# EAGLE design MagnetLCD (EAGLE 5.11)
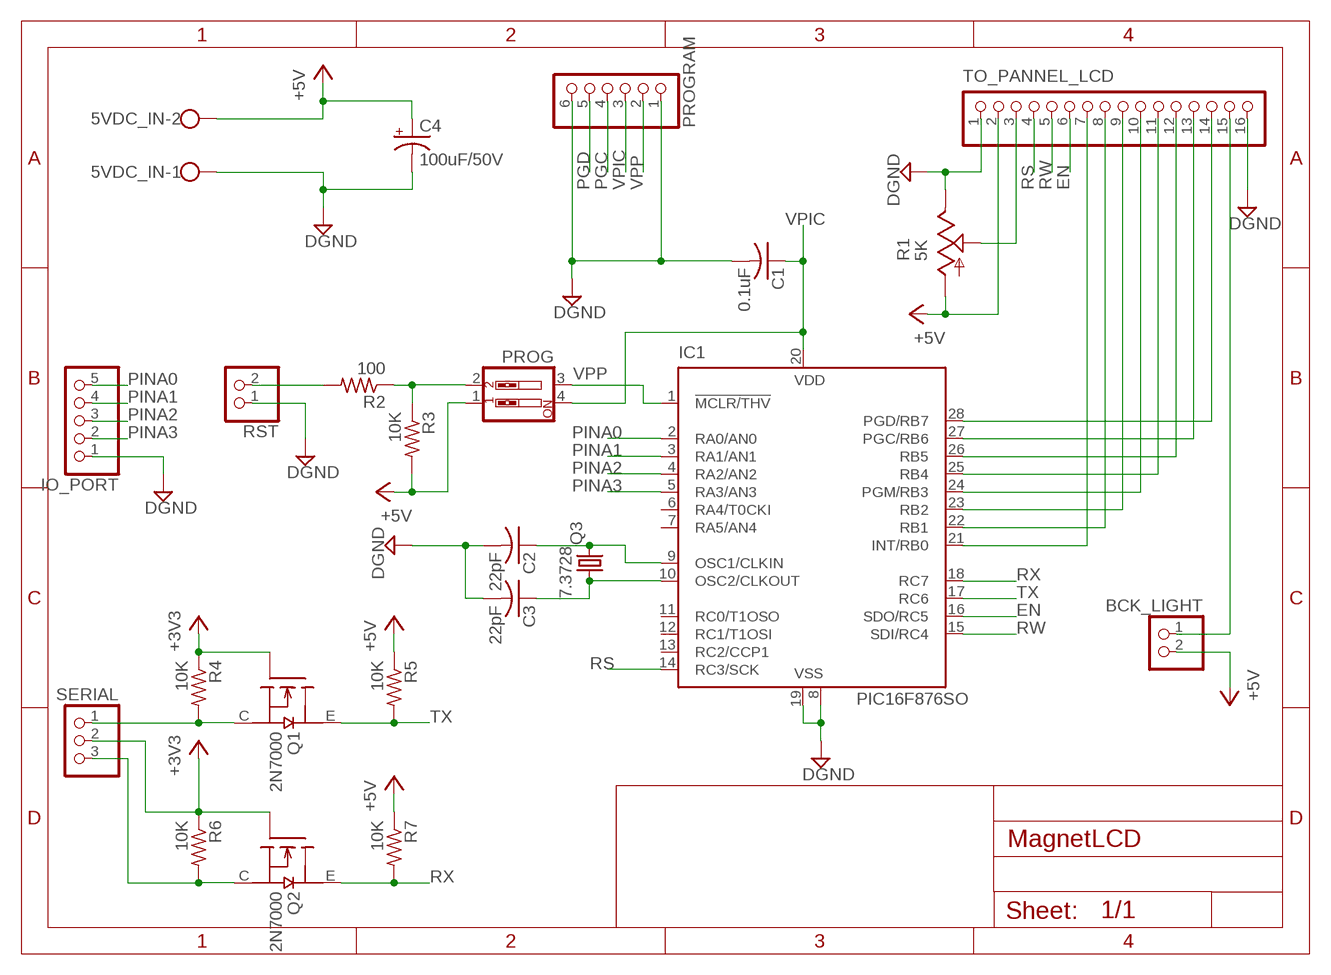
[diagram p0: schematic, sheet 1]

## Parts
5VDC_IN  W237-102  [W237-102]
BCK_LIGHT  PINHD-1X2  [1X02]
C1  0.1uF  C-USC0603  [C0603]
C2  22pF  C-USC0603  [C0603]
C3  22pF  C-USC0603  [C0603]
C4  100uF/50V  CPOL-USE3.5-8  [E3,5-8]
IC1  PIC16F876SO  [SO28W]
IO_PORT  PINHD-1X5/90  [1X05/90]
PROG  SW_DIP-2  [EDG-02]
PROGRAM  PINHD-1X6/90  [1X06/90]
Q1  2N7000  [TO92]
Q2  2N7000  [TO92]
Q3  7.3728  CRYSTALSM49  [SM49]
R1  5K  TRIM_US-CA9V  [CA9V]
R2  100  R-US_R0603  [R0603]
R3  10K  R-US_R0603  [R0603]
R4  10K  R-US_R0603  [R0603]
R5  10K  R-US_R0603  [R0603]
R6  10K  R-US_R0603  [R0603]
R7  10K  R-US_R0603  [R0603]
RST  PINHD-1X2/90  [1X02/90]
SERIAL  PINHD-1X3/90  [1X03/90]
TO_PANNEL_LCD  PINHD-1X16  [1X16]

## Nets
+3V3: Q1.B(G) Q2.B(G) R4.1 R6.1 SERIAL.2
+5V: 5VDC_IN.2 BCK_LIGHT.2 C4.+ PROG.1 R1.A R3.2 R5.1 R7.1 TO_PANNEL_LCD.2
DGND: 5VDC_IN.1 C1.2 C2.2 C3.2 C4.- IC1.8(VSS) IC1.19(VSS) IO_PORT.1 PROGRAM.1 PROGRAM.6 R1.E RST.1 TO_PANNEL_LCD.1 TO_PANNEL_LCD.16
EN: IC1.16(SDO/RC5) TO_PANNEL_LCD.6
N$1: R1.S TO_PANNEL_LCD.3
N$2: IC1.21(INT/RB0) TO_PANNEL_LCD.7
N$3: IC1.22(RB1) TO_PANNEL_LCD.8
N$4: IC1.23(RB2) TO_PANNEL_LCD.9
N$5: IC1.24(PGM/RB3) TO_PANNEL_LCD.10
N$6: IC1.25(RB4) TO_PANNEL_LCD.11
N$7: IC1.26(RB5) TO_PANNEL_LCD.12
N$8: PROG.2 R2.1 R3.1
N$9: R2.2 RST.2
N$10: Q1.C(S) R4.2 SERIAL.1
N$11: Q2.C(S) R6.2 SERIAL.3
N$12: C2.1 IC1.9(OSC1/CLKIN) Q3.2
N$13: C3.1 IC1.10(OSC2/CLKOUT) Q3.1
N$18: BCK_LIGHT.1 TO_PANNEL_LCD.15
PGC: IC1.27(PGC/RB6) PROGRAM.4 TO_PANNEL_LCD.13
PGD: IC1.28(PGD/RB7) PROGRAM.5 TO_PANNEL_LCD.14
PINA0: IC1.2(RA0/AN0) IO_PORT.5
PINA1: IC1.3(RA1/AN1) IO_PORT.4
PINA2: IC1.4(RA2/AN2) IO_PORT.3
PINA3: IC1.5(RA3/AN3) IO_PORT.2
RS: IC1.14(RC3/SCK) TO_PANNEL_LCD.4
RW: IC1.15(SDI/RC4) TO_PANNEL_LCD.5
RX: IC1.18(RC7) Q2.E(D) R7.2
TX: IC1.17(RC6) Q1.E(D) R5.2
VPIC: C1.1 IC1.20(VDD) PROG.4 PROGRAM.3
VPP: IC1.1(!MCLR/THV) PROG.3 PROGRAM.2
Unconnected: IC1.6(RA4/T0CKI) IC1.7(RA5/AN4) IC1.11(RC0/T1OSO) IC1.12(RC1/T1OSI) IC1.13(RC2/CCP1)

## Library data of the parts
5VDC_IN = con-wago-500:W237-102: WAGO SCREW CLAMP; MPN: 237-102; OC_FARNELL: unknown; OC_NEWARK: 70K9898
BCK_LIGHT RST = pinhead:PINHD-1X2: PIN HEADER
C1-C3 = rcl:C-US: CAPACITOR, American symbol
C4 = rcl:CPOL-US: POLARIZED CAPACITOR, American symbol
IC1 = microchip:PIC16*876: MICROCONTROLLER flash type; MF: MICROCHIP; MPN: PIC16F876-20/SO; OC_FARNELL: 9761268; OC_NEWARK: 12C1950
IO_PORT = pinhead:PINHD-1X5: PIN HEADER
PROG = special:SW_DIP-2: DIP SWITCH
PROGRAM = pinhead:PINHD-1X6: PIN HEADER
Q1 Q2 = Ricardo_Library:2N7000
Q3 = crystal:CRYSTAL: CRYSTAL; OC_FARNELL: unknown; OC_NEWARK: unknown
R1 = pot:TRIM_US-: POTENTIOMETER
R2-R7 = rcl:R-US_: RESISTOR, American symbol
SERIAL = pinhead:PINHD-1X3: PIN HEADER
TO_PANNEL_LCD = pinhead:PINHD-1X16: PIN HEADER

## Board
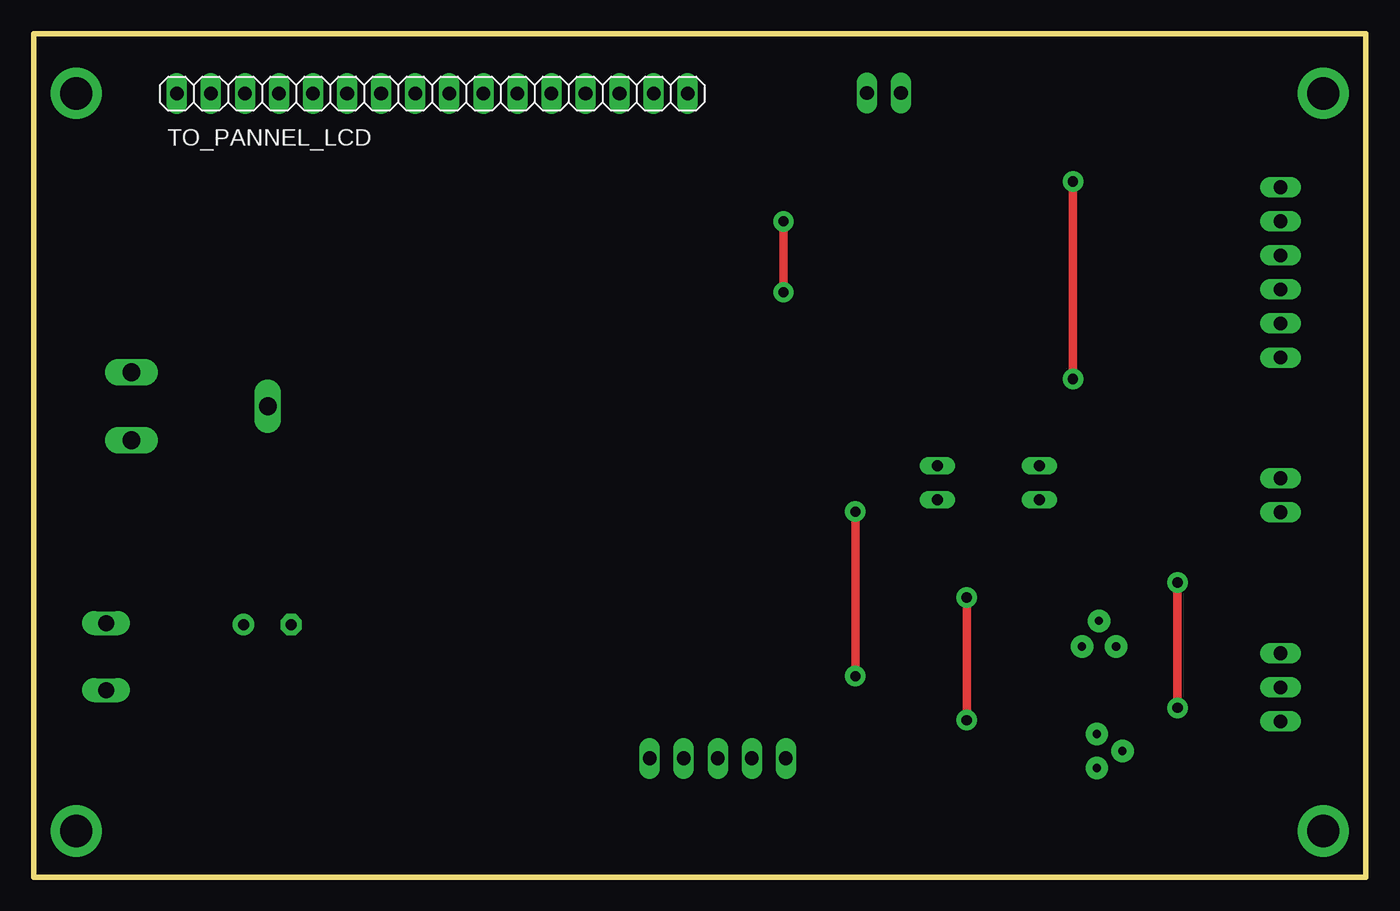
[diagram p1: board, top side]
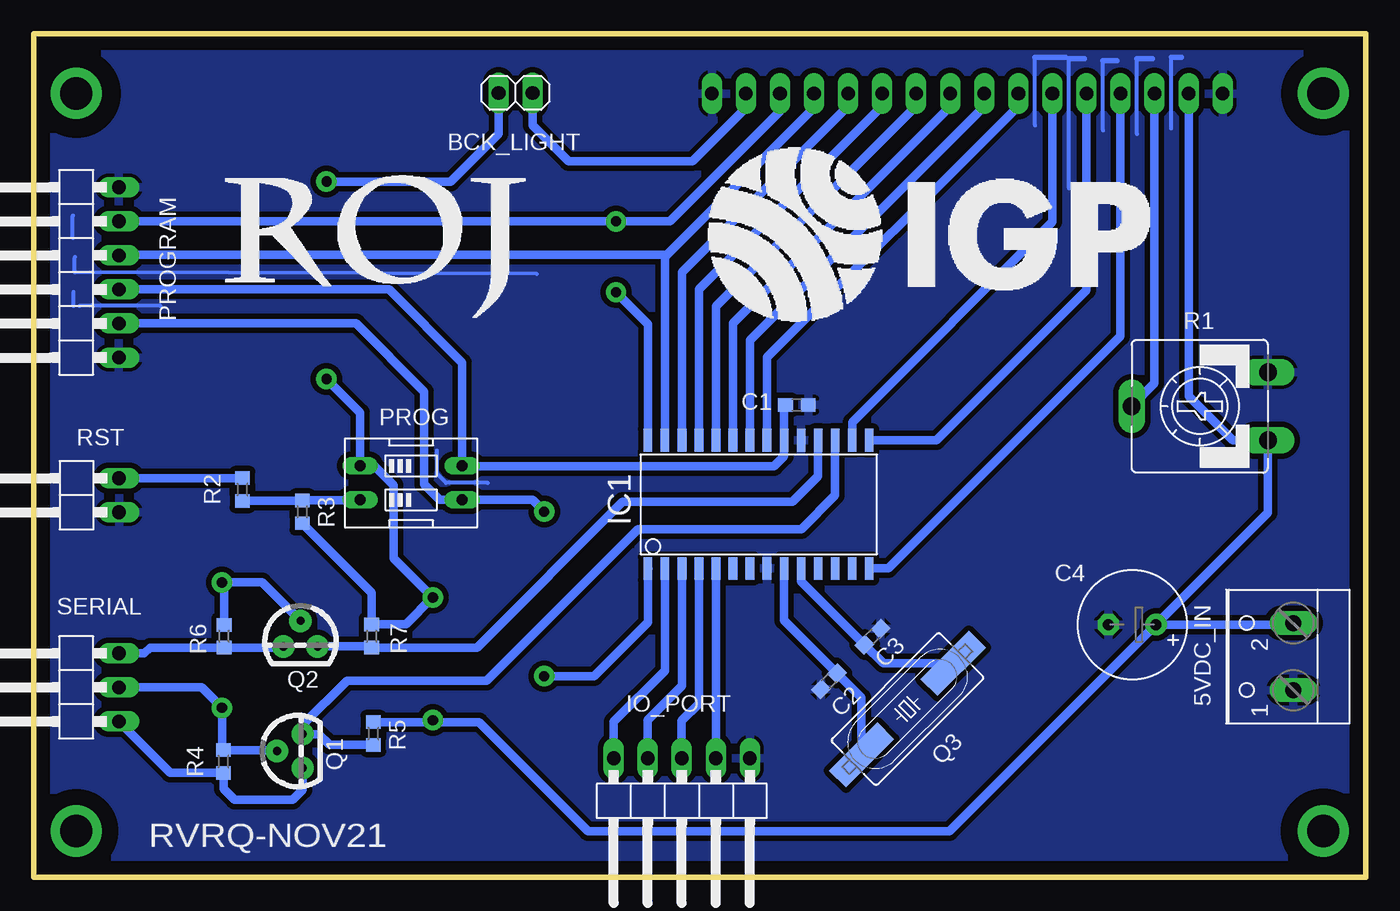
[diagram p2: board, bottom side, seen from below]

Size 99.38 x 62.9 mm. Coordinates in mm from the lower left corner, seen from the top.
Outline: 99.38,62.9 99.38,0 0,0 0,62.9 99.38,62.9
Copper layers (1*16): Top 0.035mm / dielectric 1.5mm / Bottom 0.035mm
Design rules "default": minimum track width 10mil, minimum drill 24mil, track to track 8mil, track to pad 8mil, pad to pad 8mil, via to via 8mil, smd to smd 8mil, copper to edge 40mil, drill to drill 8mil, minimum pad ring 10mil, minimum via ring 8mil, stop-mask expansion 4mil, vias tented up to drill 0mil, thermal gap 10mil
bRestrict: area 0.7,55.9 to 5.7,60.9; area 0.6,0.9 to 5.7,6; area 93.7,0.9 to 98.7,5.9; area 93.5,55.8 to 98.9,61.1

### Footprints (pad centres in the part's own frame; a part is rotated, then mirrored left to right if it is on the bottom)
W237-102 = drill 1.194 long: 1 -2.5,-0.381; 2 2.5,-0.381
1X02 = drill 1.016 long: 1 -1.27,0; 2 1.27,0
C0603 = smd 1.1 x 1: 1 -0.85,0; 2 0.85,0
E3,5-8 = drill 0.813 pad 1.6 round: + -1.778,0 | drill 0.813 pad 1.6 octagon: - 1.778,0
SO28W = smd 0.65 x 1.7: 1 -8.255,-4.78; 2 -6.985,-4.78; 3 -5.715,-4.78; 4 -4.445,-4.78; 5 -3.175,-4.78; 6 -1.905,-4.78; 7 -0.635,-4.78; 8 0.635,-4.78; 9 1.905,-4.78; 10 3.175,-4.78; 11 4.445,-4.78; 12 5.715,-4.78; 13 6.985,-4.78; 14 8.255,-4.78; 15 8.255,4.78; 16 6.985,4.78; 17 5.715,4.78; 18 4.445,4.78; 19 3.175,4.78; 20 1.905,4.78; 21 0.635,4.78; 22 -0.635,4.78; 23 -1.905,4.78; 24 -3.175,4.78; 25 -4.445,4.78; 26 -5.715,4.78; 27 -6.985,4.78; 28 -8.255,4.78
1X05/90 = drill 1.016 long: 1 -5.08,-3.81; 2 -2.54,-3.81; 3 0,-3.81; 4 2.54,-3.81; 5 5.08,-3.81
EDG-02 = drill 0.813 long: 1 -1.27,-3.81; 2 1.27,-3.81; 3 1.27,3.81; 4 -1.27,3.81
1X06/90 = drill 1.016 long: 1 -6.35,-3.81; 2 -3.81,-3.81; 3 -1.27,-3.81; 4 1.27,-3.81; 5 3.81,-3.81; 6 6.35,-3.81
TO92 = drill 0.61 pad 1.676 round: B 0,1.905; C -1.27,0; E 1.27,0
SM49 = smd 5.08 x 1.778: 1 -4.826,0; 2 4.826,0
CA9V = drill 1.321 long: A -2.54,-5.08; E 2.54,-5.08; S 0,5.08
R0603 = smd 1 x 1.1: 1 -0.85,0; 2 0.85,0
1X02/90 = drill 1.016 long: 1 -1.27,-3.81; 2 1.27,-3.81
1X03/90 = drill 1.016 long: 1 -2.54,-3.81; 2 0,-3.81; 3 2.54,-3.81
1X16 = drill 1.016 long: 1 -19.05,0; 2 -16.51,0; 3 -13.97,0; 4 -11.43,0; 5 -8.89,0; 6 -6.35,0; 7 -3.81,0; 8 -1.27,0; 9 1.27,0; 10 3.81,0; 11 6.35,0; 12 8.89,0; 13 11.43,0; 14 13.97,0; 15 16.51,0; 16 19.05,0

### Placement (x,y rotation side)
5VDC_IN  5.79,16.45 90 bottom
BCK_LIGHT  63.43,58.47 180 bottom
C1  42.44,35.21 0 bottom
C2  40.06,14.61 225 bottom
C3  36.8,17.94 45 bottom
C4  17.44,18.83 180 bottom
IC1  45.3,27.8 0 bottom
IO_PORT  51.03,5.06 180 bottom
PROG  71.22,29.4 270 bottom
PROGRAM  96.83,45.09 90 bottom
Q1  79.31,9.41 90 bottom
Q2  79.47,17.21 0 bottom
Q3  34.2,12.53 225 bottom
R1  12.39,35.11 90 bottom
R2  83.8,28.91 90 bottom
R3  79.33,27.24 270 bottom
R4  85.21,8.63 270 bottom
R5  74.03,10.71 270 bottom
R6  85.17,17.97 270 bottom
R7  74.16,17.98 270 bottom
RST  96.81,28.48 90 bottom
SERIAL  96.83,14.15 90 bottom
TO_PANNEL_LCD  29.74,58.42 0 top

### Tracks (layer width: path | path; a pad name or v marks a point on that pad's centre or on a via)
+3V3  (via drill 0.76 pad 1.52)
  Top 0.635: v85.32,12.63 v85.32,21.97
  Bottom 0.635: Q1.B 81.28,9.48 R4.1 85.32,9.58 v85.32,12.63 86.85,14.15 SERIAL.2 | v85.32,21.97 84.81,21.97 | 84.81,21.97 82.33,21.97 Q2.B | R6.1 85.17,21.62 84.81,21.97
+5V  (via drill 0.76 pad 1.52)
  Top 0.635: v77.52,37.14 v77.52,51.87 | v69.6,11.71 v69.6,20.86
  Bottom 0.635: BCK_LIGHT.2 64.7,55.44 68.26,51.87 v77.52,51.87 | C4.+ 31.06,3.43 58.02,3.43 66.15,11.56 69.6,11.56 | 5VDC_IN.2 5.53,18.83 C4.+ | TO_PANNEL_LCD.2 13.23,35.86 9.94,32.57 R1.A 7.31,27.18 C4.+ | 69.6,11.56 v69.6,11.71 | 69.6,11.56 R5.1 | R3.2 74.16,21.22 R7.1 74.13,18.85 71.61,18.85 v69.6,20.86 72.53,23.79 72.53,29.23 73.97,30.67 PROG.1 75.03,34.64 v77.52,37.14
DGND
  Bottom 0.305: 14.53,55.81 14.53,61.14 | 17.07,55.43 17.07,61.01 | 19.61,55.68 19.61,60.89 | 24.69,56.06 24.69,61.14 | 22.15,51.36 22.15,61.01 | 96.45,47.65 96.45,49.33 | 96.3,46.23 96.3,45.09 61.85,44.98 | 96.4,42.57 96.4,43.62 | 89.89,42.6 95.94,42.6 | 65.49,29.4 68.62,29.4 69.29,30.07 69.29,31.8
  Bottom 0.406: 14.53,61.14 13.77,61.14 | 17.07,61.01 15.93,61.01 | 19.61,60.89 18.6,60.89 | 24.69,61.14 22.41,61.14 | 22.15,61.01 21.01,61.01
  pour Bottom (isolate 0.406): 0.05,63.3 100,63.3 100,-0.2 0.05,-0.2
EN
  Bottom 0.635: TO_PANNEL_LCD.6 23.39,48.86 38.32,33.93 IC1.16
N$1
  Bottom 0.635: TO_PANNEL_LCD.3 15.77,36.82 R1.S
N$2
  Bottom 0.635: TO_PANNEL_LCD.7 25.93,57.49 44.67,38.75 IC1.21
N$3
  Bottom 0.635: TO_PANNEL_LCD.8 28.47,57.49 45.94,40.02 IC1.22
N$4
  Bottom 0.635: TO_PANNEL_LCD.9 31.01,57.49 47.21,41.29 IC1.23
N$5
  Bottom 0.635: TO_PANNEL_LCD.10 33.55,57.49 48.48,42.56 IC1.24
N$6
  Bottom 0.635: TO_PANNEL_LCD.11 36.09,57.49 49.75,43.83 IC1.25
N$7
  Bottom 0.635: TO_PANNEL_LCD.12 38.63,57.49 51.02,45.1 IC1.26
N$8
  Bottom 0.635: 83.77,28.03 R2.1 79.36,28.06 R3.1 75.07,28.09 PROG.2
N$9
  Bottom 0.635: R2.2 RST.2
N$10
  Bottom 0.635: SERIAL.1 89.18,7.78 R4.2 85.21,6.6 84.38,5.77 80.06,5.77 79.31,6.53 Q1.C
N$11
  Bottom 0.635: Q2.C 80.82,17.12 R6.2 90.68,17.12 91.11,16.69 SERIAL.3
N$12
  Bottom 0.635: IC1.9 43.4,19.15 C2.1 37.62,13.37 Q3.2
N$13
  Bottom 0.635: IC1.10 42.13,22.07 C3.1 36.01,15.95 Q3.1
N$14  (via drill 2.41 pad 3.81)
  other vias: 3.19,3.44
N$15  (via drill 2.41 pad 3.81)
  other vias: 3.19,58.44
N$16  (via drill 2.41 pad 3.81)
  other vias: 96.19,3.44
N$17  (via drill 2.41 pad 3.81)
  other vias: 96.19,58.44
N$18
  Bottom 0.635: TO_PANNEL_LCD.15 46.25,57.36 50.22,53.39 59.49,53.39 62.16,56.06 BCK_LIGHT.1
PGC
  Bottom 0.635: PROGRAM.4 92.97,46.41 52.12,46.41 | TO_PANNEL_LCD.13 41.17,57.36 52.12,46.41 | 52.12,46.41 52.29,46.24 IC1.27
PGD  (via drill 0.76 pad 1.52)
  Top 0.635: v55.93,43.62 v55.93,48.9
  Bottom 0.635: PROGRAM.5 v55.93,48.9 51.91,48.9 43.71,57.11 TO_PANNEL_LCD.14 | IC1.28 53.56,41.24 v55.93,43.62
PINA0
  Bottom 0.635: IC1.2 52.29,15.41 56.11,11.59 IO_PORT.5
PINA1
  Bottom 0.635: IC1.3 51.02,14.27 53.57,11.71 IO_PORT.4
PINA2
  Bottom 0.635: IC1.4 49.75,12.95 51.03,11.66 IO_PORT.3
PINA3
  Bottom 0.635: IC1.5 48.49,23.01 IO_PORT.2
RS
  Bottom 0.635: TO_PANNEL_LCD.4 18.31,40.35 35.63,23.02 IC1.14
RW
  Bottom 0.635: TO_PANNEL_LCD.5 20.85,43.77 32.04,32.58 IC1.15
RX
  Bottom 0.635: Q2.E 74.24,17.21 R7.2 66.29,17.13 55.44,27.98 42.76,27.98 40.86,29.89 IC1.18
TX
  Bottom 0.635: 74.06,9.84 R5.2 77.3,9.86 78.12,10.68 Q1.E 79.31,11.35 76,14.66 65.59,14.66 54.31,25.94 42.12,25.94 39.59,28.46 IC1.17
VPIC
  Bottom 0.635: C1.1 43.4,35.11 IC1.20 43.4,31.38 44.14,30.63 67.37,30.63 PROG.4 67.41,38.36 72.87,43.82 PROGRAM.3
VPP  (via drill 0.76 pad 1.52)
  Top 0.635: v61.29,14.99 v61.29,27.26
  Bottom 0.635: PROGRAM.2 75.32,41.28 70.24,36.2 70.24,29.29 69.08,28.13 PROG.3 62.17,28.13 v61.29,27.26 | 53.52,22.98 IC1.1 53.56,19.01 57.59,14.99 v61.29,14.99

### Text on the board
bPlace: RVRQ-NOV21